# Altium schematic sheet Level Shifter.SchDoc
size A4
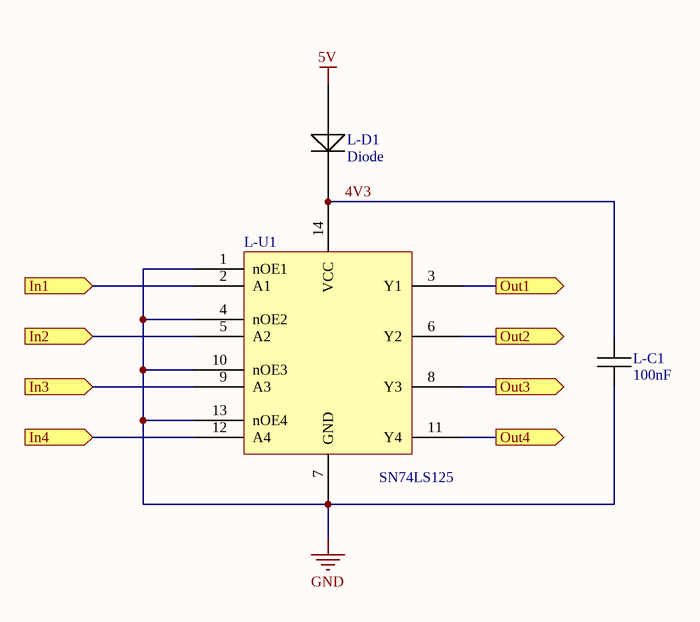
[diagram p0: Level Shifter.SchDoc]

## Parts
L-C1  100nF  [C 0805 / 2012]
L-D1  Diode  [DO-41]
L-U1  SN74LS125  [DIP-14]

## Ports
In1 (in), In2 (in), In3 (in), In4 (in), Out1 (out), Out2 (out), Out3 (out), Out4 (out)

## Nets
5V: L-D1.2
GND: L-C1.2 L-U1.1(nOE1) L-U1.4(nOE2) L-U1.7(GND) L-U1.10(nOE3) L-U1.13(nOE4)
4V3: L-C1.1 L-D1.1 L-U1.14(VCC)
In1: L-U1.2(A1) ; port In1
In2: L-U1.5(A2) ; port In2
In3: L-U1.9(A3) ; port In3
In4: L-U1.12(A4) ; port In4
Out1: L-U1.3(Y1) ; port Out1
Out2: L-U1.6(Y2) ; port Out2
Out3: L-U1.8(Y3) ; port Out3
Out4: L-U1.11(Y4) ; port Out4

## Library data of the parts
L-C1 = Capacitor
L-U1 = 74xx125: Quad 3-State Buffers